# EAGLE schematic Eurorack_Audio_IO (EAGLE 9.5.2)
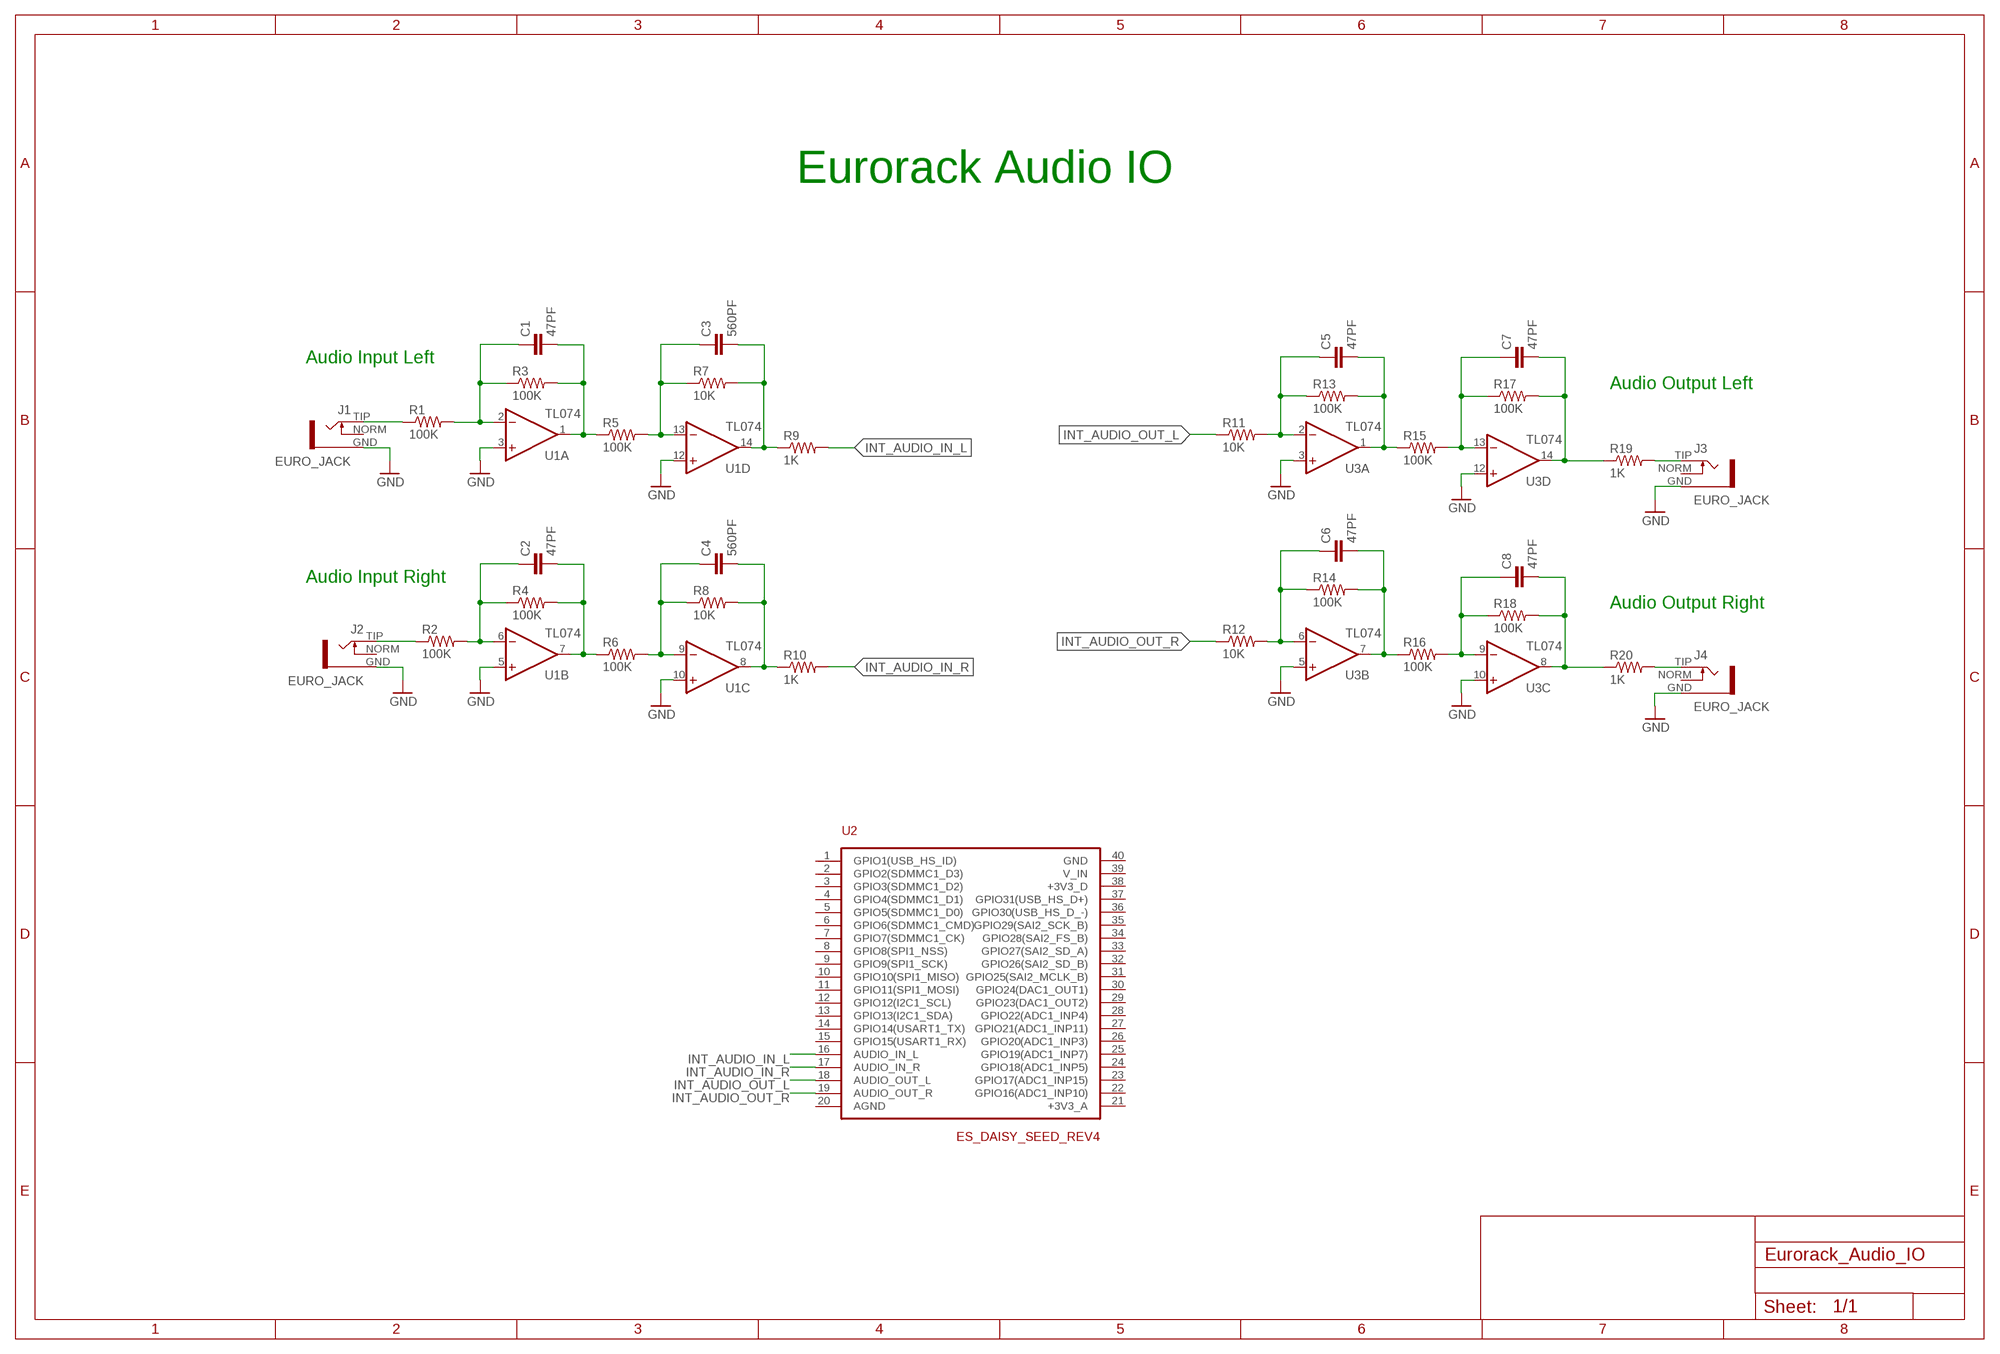
[diagram p0: schematic, sheet 1]

## Parts
C1  47PF  C-EUC0603  [C0603]
C2  47PF  C-EUC0603  [C0603]
C3  560PF  C-EUC0603  [C0603]
C4  560PF  C-EUC0603  [C0603]
C5  47PF  C-EUC0603  [C0603]
C6  47PF  C-EUC0603  [C0603]
C7  47PF  C-EUC0603  [C0603]
C8  47PF  C-EUC0603  [C0603]
J1  EURO_JACK  [S_JACK]
J2  EURO_JACK  [S_JACK]
J3  EURO_JACK  [S_JACK]
J4  EURO_JACK  [S_JACK]
R1  100K  R-US_R0603  [R0603]
R2  100K  R-US_R0603  [R0603]
R3  100K  R-US_R0603  [R0603]
R4  100K  R-US_R0603  [R0603]
R5  100K  R-US_R0603  [R0603]
R6  100K  R-US_R0603  [R0603]
R7  10K  R-US_R0603  [R0603]
R8  10K  R-US_R0603  [R0603]
R9  1K  R-US_R0603  [R0603]
R10  1K  R-US_R0603  [R0603]
R11  10K  R-US_R0603  [R0603]
R12  10K  R-US_R0603  [R0603]
R13  100K  R-US_R0603  [R0603]
R14  100K  R-US_R0603  [R0603]
R15  100K  R-US_R0603  [R0603]
R16  100K  R-US_R0603  [R0603]
R17  100K  R-US_R0603  [R0603]
R18  100K  R-US_R0603  [R0603]
R19  1K  R-US_R0603  [R0603]
R20  1K  R-US_R0603  [R0603]
U1  TL074  TL074_TSSOP-14  [TSSOP-14]
U2  ES_DAISY_SEED_REV4  [ES_DAISY_SEED]
U3  TL074  TL074_TSSOP-14  [TSSOP-14]

## Nets
AUDIO_IN_L: J1.TIP R1.1
AUDIO_IN_L1: J2.TIP R2.1
GND: J1.GND J2.GND J3.GND J4.GND U1.3(A:+IN) U1.5(B:+IN) U1.10(C:+IN) U1.12(D:+IN) U3.3(A:+IN) U3.5(B:+IN) U3.10(C:+IN) U3.12(D:+IN)
INT_AUDIO_IN_L: R9.2 U2.16(AUDIO_IN_L)
INT_AUDIO_IN_R: R10.2 U2.17(AUDIO_IN_R)
INT_AUDIO_OUT_L: R11.1 U2.18(AUDIO_OUT_L)
INT_AUDIO_OUT_R: R12.1 U2.19(AUDIO_OUT_R)
N$1: J3.TIP R19.2
N$2: J4.TIP R20.2
N$5: C3.1 R5.2 R7.1 U1.13(D:-IN)
N$67: C1.1 R1.2 R3.1 U1.2(A:-IN)
N$69: C1.2 R3.2 R5.1 U1.1(A:OUT)
N$70: C2.1 R2.2 R4.1 U1.6(B:-IN)
N$71: C2.2 R4.2 R6.1 U1.7(B:OUT)
N$80: C7.1 R15.2 R17.1 U3.13(D:-IN)
N$82: C7.2 R17.2 R19.1 U3.14(D:OUT)
N$85: C4.1 R6.2 R8.1 U1.9(C:-IN)
N$86: C8.1 R16.2 R18.1 U3.9(C:-IN)
N$88: C8.2 R18.2 R20.1 U3.8(C:OUT)
N$100: C4.2 R8.2 R10.1 U1.8(C:OUT)
N$101: C3.2 R7.2 R9.1 U1.14(D:OUT)
N$105: C5.1 R11.2 R13.1 U3.2(A:-IN)
N$106: C5.2 R13.2 R15.1 U3.1(A:OUT)
N$108: C6.1 R12.2 R14.1 U3.6(B:-IN)
N$110: C6.2 R14.2 R16.1 U3.7(B:OUT)
Unconnected: J1.NORM J2.NORM J3.NORM J4.NORM U2.1(GPIO1(USB_HS_ID)) U2.2(GPIO2(SDMMC1_D3)) U2.3(GPIO3(SDMMC1_D2)) U2.4(GPIO4(SDMMC1_D1)) U2.5(GPIO5(SDMMC1_D0)) U2.6(GPIO6(SDMMC1_CMD)) U2.7(GPIO7(SDMMC1_CK)) U2.8(GPIO8(SPI1_NSS)) U2.9(GPIO9(SPI1_SCK)) U2.10(GPIO10(SPI1_MISO)) U2.11(GPIO11(SPI1_MOSI)) U2.12(GPIO12(I2C1_SCL)) U2.13(GPIO13(I2C1_SDA)) U2.14(GPIO14(USART1_TX)) U2.15(GPIO15(USART1_RX)) U2.20(AGND) U2.21(+3V3_A) U2.22(GPIO16(ADC1_INP10)) U2.23(GPIO17(ADC1_INP15)) U2.24(GPIO18(ADC1_INP5)) U2.25(GPIO19(ADC1_INP7)) U2.26(GPIO20(ADC1_INP3)) U2.27(GPIO21(ADC1_INP11)) U2.28(GPIO22(ADC1_INP4)) U2.29(GPIO23(DAC1_OUT2)) U2.30(GPIO24(DAC1_OUT1)) U2.31(GPIO25(SAI2_MCLK_B)) U2.32(GPIO26(SAI2_SD_B)) U2.33(GPIO27(SAI2_SD_A)) U2.34(GPIO28(SAI2_FS_B)) U2.35(GPIO29(SAI2_SCK_B)) U2.36(GPIO30(USB_HS_D_-)) U2.37(GPIO31(USB_HS_D+)) U2.38(+3V3_D) U2.39(V_IN) U2.40(GND)

## Notes on the sheet
- Eurorack Audio IO
- Audio Input Left
- Audio Output Left
- Audio Input Right
- Audio Output Right

## Power pins joined to a net without a drawn wire
V+: U1.4(P:V+) U3.4(P:V+)
V-: U1.11(P:V-) U3.11(P:V-)

## Library data of the parts
C1-C8 = Electrosmith-Passives:C-EU: CAPACITOR, European symbol; PACKAGE: C0603
J1-J4 = Electrosmith-Interface:EURO_JACK
R1-R20 = Electrosmith-Passives:R-US_: RESISTOR, American symbol; PACKAGE: R0603
U1 U3 = Electrosmith-IC:TL074: OP AMP; BIN#: 12-011; IPN: TL074 TSSOP-14; MPN: TL074CPWR; PACKAGE: TSSOP-14
U2 = Electrosmith-Boards:ES_DAISY_SEED_REV4; IPN: Daisy Seed

## Net classes
0 default: width 0.203 mm